# Altium schematic sheet PA_Combined_RX_TX.SchDoc
size A2; SheetNumber: 1; SheetTotal: 1
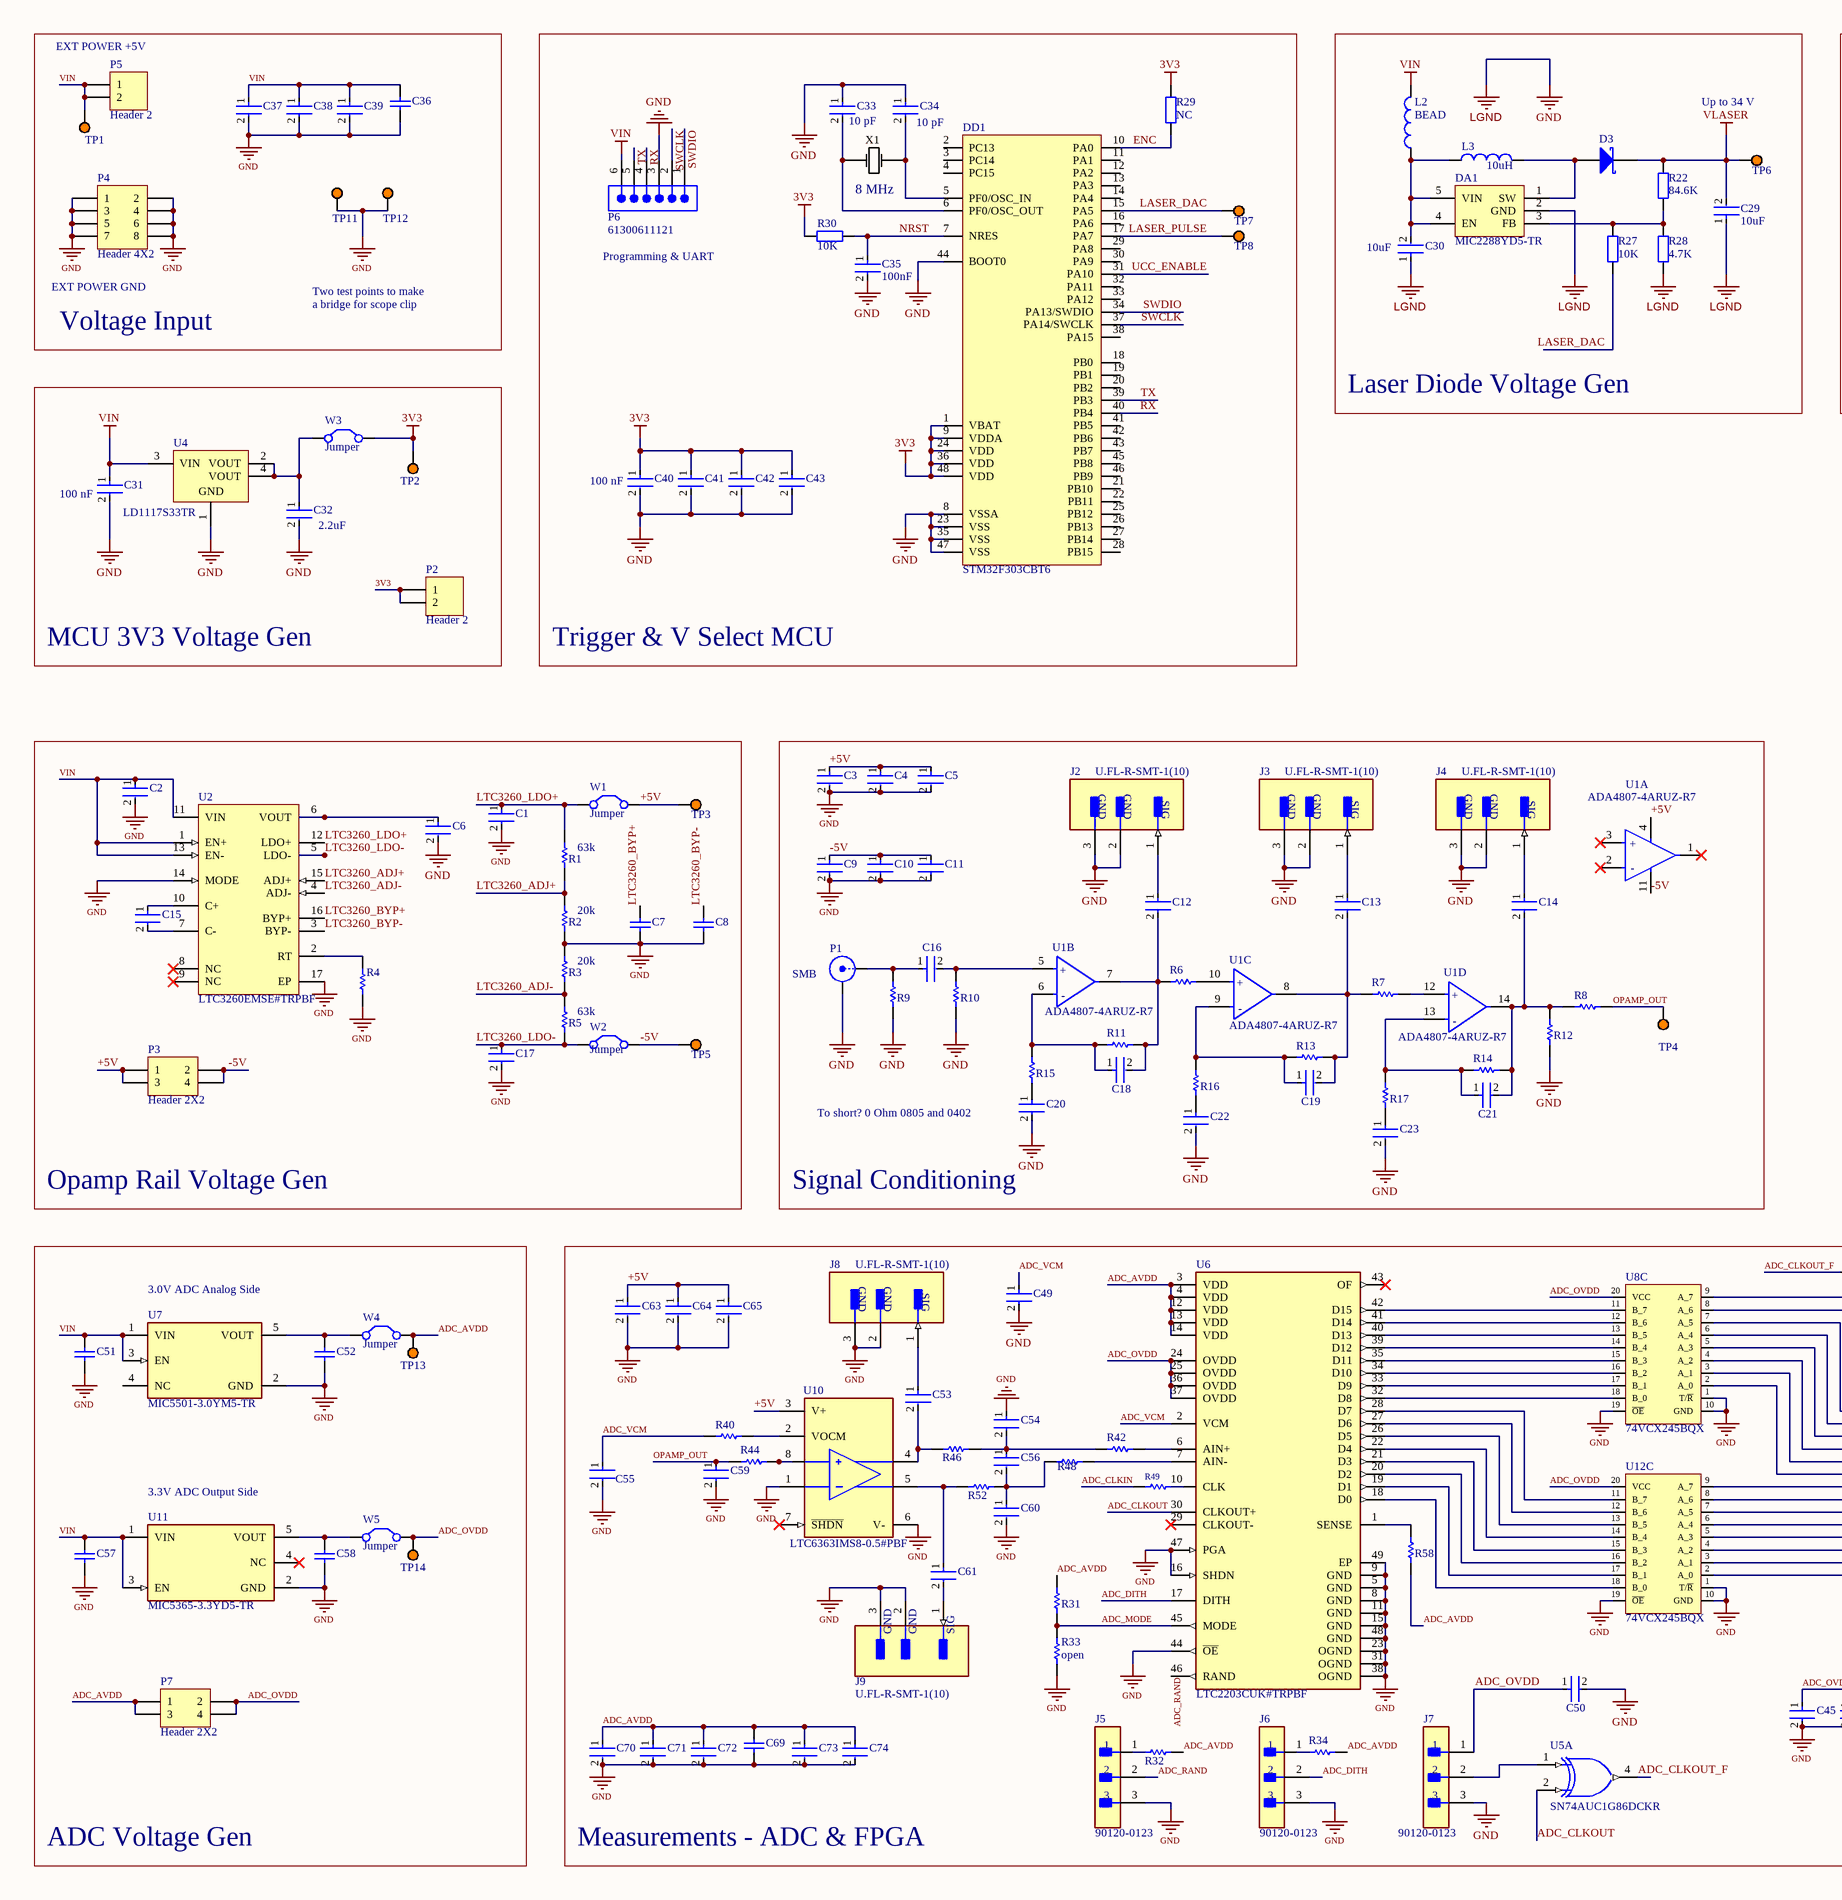
[diagram p0: PA_Combined_RX_TX.SchDoc, left]
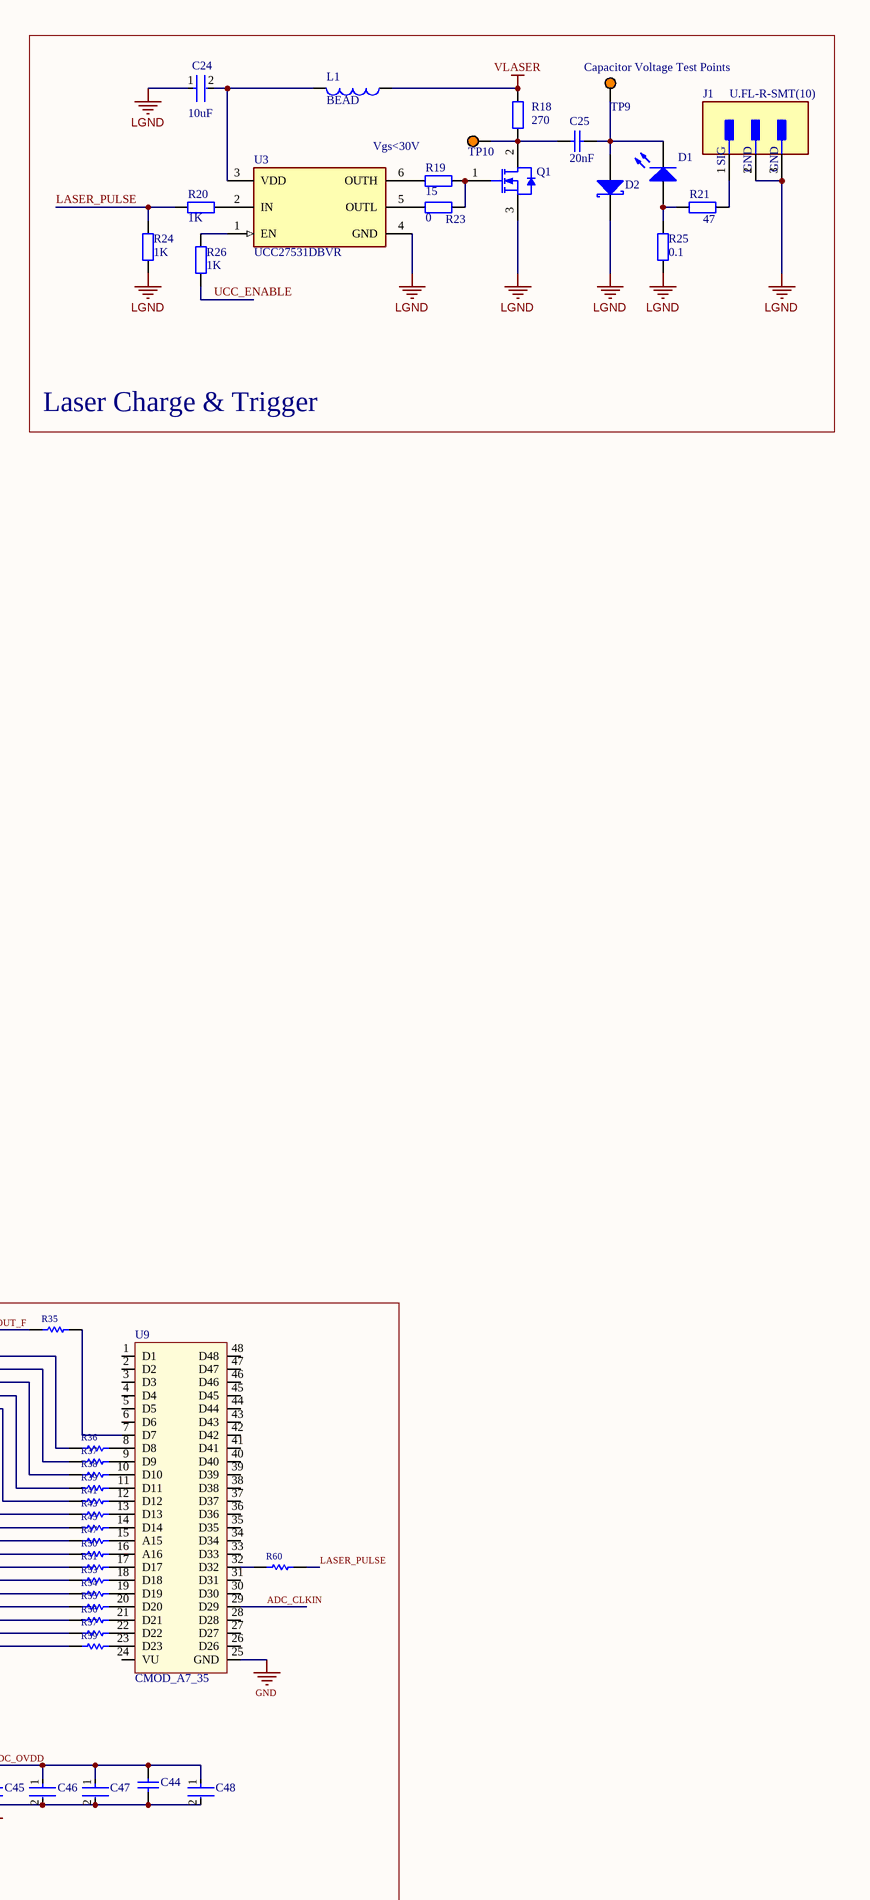
[diagram p1: PA_Combined_RX_TX.SchDoc, right]

## Parts
C1  CL21B106KOQNNNG  [FP-CL21B106KOQNNNG-MFG]  (value not drawn)
C2  CL21B106KOQNNNG  [FP-CL21B106KOQNNNG-MFG]  (value not drawn)
C3  CL21B106KOQNNNG  [FP-CL21B106KOQNNNG-MFG]  (value not drawn)
C4  GRM21BR71C475KE51K  [FP-GRM21B-0_15-MFG]  (value not drawn)
C5  C0805C104K5RACTU  [FP-C0805C-DN-MFG]  (value not drawn)
C6  CL21B106KOQNNNG  [FP-CL21B106KOQNNNG-MFG]  (value not drawn)
C7  C0805F103K5RACTU  [CAPC2013X100X50NL20T25]  (value not drawn)
C8  C0805F103K5RACTU  [CAPC2013X100X50NL20T25]  (value not drawn)
C9  CL21B106KOQNNNG  [FP-CL21B106KOQNNNG-MFG]  (value not drawn)
C10  GRM21BR71C475KE51K  [FP-GRM21B-0_15-MFG]  (value not drawn)
C11  C0805C104K5RACTU  [FP-C0805C-DN-MFG]  (value not drawn)
C12  C0805C102K5RACTU  [FP-C0805C-DN-MFG]  (value not drawn)
C13  C0805C102K5RACTU  [FP-C0805C-DN-MFG]  (value not drawn)
C14  C0805C102K5RACTU  [FP-C0805C-DN-MFG]  (value not drawn)
C15  CL21B105KAFNNNG  [FP-CL21-IPC_C]  (value not drawn)
C16  CL21B222JBANNNC  [FP-CL21-IPC_B]  (value not drawn)
C17  CL21B106KOQNNNG  [FP-CL21B106KOQNNNG-MFG]  (value not drawn)
C18  C0805C150K5RACTU  [FP-C0805C-DN-MFG]  (value not drawn)
C19  C0805C150K5RACTU  [FP-C0805C-DN-MFG]  (value not drawn)
C20  CL21B106KOQNNNG  [FP-CL21B106KOQNNNG-MFG]  (value not drawn)
C21  C0805C150K5RACTU  [FP-C0805C-DN-MFG]  (value not drawn)
C22  CL21B106KOQNNNG  [FP-CL21B106KOQNNNG-MFG]  (value not drawn)
C23  CL21B106KOQNNNG  [FP-CL21B106KOQNNNG-MFG]  (value not drawn)
C24  10uF  [FP-CL31B106KBHNNNE-MFG]
C25  20nF  [RESC2013X60X35ML10T20]
C29  10uF  [FP-CL31B106KBHNNNE-MFG]
C30  10uF  [FP-CL31B106KBHNNNE-MFG]
C31  value 100 nF  [FP-CC0603-DA-MFG]
C32  Capacitance: 2.2uF  [FP-CL10-IPC_A]
C33  value 10 pF  [FP-C0805C-DN-MFG]  (hidden comment: C0805C100J5RACTU)
C34  value 10 pF  [FP-C0805C-DN-MFG]
C35  100nF  [FP-CC0805-0_85-MFG]
C36  C0805C105K3RACTU  [CAPC2013X140X50LL20T25]  (value not drawn)
C37  CL21B106KOQNNNG  [FP-CL21B106KOQNNNG-MFG]  (value not drawn)
C38  GRM21BR71C475KE51K  [FP-GRM21B-0_15-MFG]  (value not drawn)
C39  C0805C104K5RACTU  [FP-C0805C-DN-MFG]  (value not drawn)
C40  Capacitance: 100 nF  [FP-CC0805-0_85-MFG]  (hidden comment: CC0805KRX7R9BB104)
C41  CC0805KRX7R9BB104  [FP-CC0805-0_85-MFG]  (value not drawn)
C42  CC0805KRX7R9BB104  [FP-CC0805-0_85-MFG]  (value not drawn)
C43  CC0805KRX7R9BB104  [FP-CC0805-0_85-MFG]  (value not drawn)
C44  C0805C105K3RACTU  [CAPC2013X140X50LL20T25]  (value not drawn)
C45  CL21B106KOQNNNG  [FP-CL21B106KOQNNNG-MFG]  (value not drawn)
C46  GRM21BR71C475KE51K  [FP-GRM21B-0_15-MFG]  (value not drawn)
C47  C0805C104K5RACTU  [FP-C0805C-DN-MFG]  (value not drawn)
C48  C0805C104K5RACTU  [FP-C0805C-DN-MFG]  (value not drawn)
C49  C2012X7R1C225K125AB  [FP-C2012-125-0_2-MFG]  (value not drawn)
C50  C0805C104K5RACTU  [FP-C0805C-DN-MFG]  (value not drawn)
C51  C0805C105K3RACTU  [CAPC2013X140X50LL20T25]  (value not drawn)
C52  C0805C105K3RACTU  [CAPC2013X140X50LL20T25]  (value not drawn)
C53  C0805C102K5RACTU  [FP-C0805C-DN-MFG]  (value not drawn)
C54  C0805C100J5RACTU  [FP-C0805C-DN-MFG]  (value not drawn)
C55  C0805C104K5RACTU  [FP-C0805C-DN-MFG]  (value not drawn)
C56  C0805C100J5RACTU  [FP-C0805C-DN-MFG]  (value not drawn)
C57  C0805C105K3RACTU  [CAPC2013X140X50LL20T25]  (value not drawn)
C58  C0805C105K3RACTU  [CAPC2013X140X50LL20T25]  (value not drawn)
C59  C0805C100J5RACTU  [FP-C0805C-DN-MFG]  (value not drawn)
C60  C0805C100J5RACTU  [FP-C0805C-DN-MFG]  (value not drawn)
C61  C0805C102K5RACTU  [FP-C0805C-DN-MFG]  (value not drawn)
C63  CL21B106KOQNNNG  [FP-CL21B106KOQNNNG-MFG]  (value not drawn)
C64  GRM21BR71C475KE51K  [FP-GRM21B-0_15-MFG]  (value not drawn)
C65  C0805C104K5RACTU  [FP-C0805C-DN-MFG]  (value not drawn)
C69  C0805C105K3RACTU  [CAPC2013X140X50LL20T25]  (value not drawn)
C70  CL21B106KOQNNNG  [FP-CL21B106KOQNNNG-MFG]  (value not drawn)
C71  GRM21BR71C475KE51K  [FP-GRM21B-0_15-MFG]  (value not drawn)
C72  C0805C104K5RACTU  [FP-C0805C-DN-MFG]  (value not drawn)
C73  C0805C104K5RACTU  [FP-C0805C-DN-MFG]  (value not drawn)
C74  C0805C104K5RACTU  [FP-C0805C-DN-MFG]  (value not drawn)
D1  Light-Emitting Diode  [FP-DPGEW1S09H-MFG]  (value not drawn)
D2  Schottky Diode  [FP-PG-SC79-2-MFG]  (value not drawn)
D3  Schottky Diode  [FP-PG-SC79-2-MFG]  (value not drawn)
DA1  MIC2288YD5-TR  [FP-TSOT-5LD-PL-1-IPC_A]
DD1  STM32F303CBT6  [STM-LQFP48_L]
J1  U.FL-R-SMT(10)  [FP-U_FL-R-SMT_10-MFG]
J2  U.FL-R-SMT-1(10)  [FP-U_FL-R-SMT-1_10-MFG]
J3  U.FL-R-SMT-1(10)  [FP-U_FL-R-SMT-1_10-MFG]
J4  U.FL-R-SMT-1(10)  [FP-U_FL-R-SMT-1_10-MFG]
J5  90120-0123  [FP-90120-0123-MFG]
J6  90120-0123  [FP-90120-0123-MFG]
J7  90120-0123  [FP-90120-0123-MFG]
J8  U.FL-R-SMT-1(10)  [FP-U_FL-R-SMT-1_10-MFG]
J9  U.FL-R-SMT-1(10)  [FP-U_FL-R-SMT-1_10-MFG]
L1  BEAD  [FP-BLM18-0_15-t0_8-IPC_A]
L2  BEAD  [FP-BLM18-0_15-t0_8-IPC_A]
L3  value 10uH  [RESC2013X60X35LL10T20]  (hidden comment: Inductor)
P1  SMB  [SMB_V-RJ45]
P2  Header 2  [HDR1X2]
P3  Header 2X2  [HDR2X2]
P4  Header 4X2  [HDR2X4]
P5  Header 2  [HDR1X2]
P6  61300611121  [61300611121]
P7  Header 2X2  [HDR2X2]
Q1  (no value)  [INF-PG-TO252-3-313_N]
R1  63k  [RESC2013X60X30ML20T20]
R2  20k  [RESC2013X60X30ML20T20]
R3  20k  [RESC2013X60X30ML20T20]
R4  CRCW0805200KFKEA  [RESC2013X50X30NL20T20]  (value not drawn)
R5  63k  [RESC2013X60X30ML20T20]
R6  RC0805FR-071KL  [RESC2013X60X35ML10T20]  (value not drawn)
R7  RC0805FR-071KL  [RESC2013X60X35ML10T20]  (value not drawn)
R8  ERJ-6GEY0R00V  [RESC2013X70X40NL20T20]  (value not drawn)
R9  RK73B2ATTD510J  [RESC2013X60X30ML20T20]  (value not drawn)
R10  RK73B2ATTD510J  [RESC2013X60X30ML20T20]  (value not drawn)
R11  RC0805FR-071KL  [RESC2013X60X35ML10T20]  (value not drawn)
R12  RK73B2ATTD510J  [RESC2013X60X30ML20T20]  (value not drawn)
R13  RC0805FR-071KL  [RESC2013X60X35ML10T20]  (value not drawn)
R14  RC0805FR-071KL  [RESC2013X60X35ML10T20]  (value not drawn)
R15  RC0805FR-07100RL  [RESC2013X60X35ML10T20]  (value not drawn)
R16  RC0805FR-07100RL  [RESC2013X60X35ML10T20]  (value not drawn)
R17  RC0805FR-07100RL  [RESC2013X60X35ML10T20]  (value not drawn)
R18  270  [FP-CL31B106KBHNNNE-IPC_A]
R19  15  [RESC2013X60X35ML10T20]
R20  1K  [RESC2013X60X35ML10T20]
R21  47  [RESC2013X60X35ML10T20]
R22  84.6K  [RESC2013X60X35ML10T20]
R23  0  [RESC2013X60X35ML10T20]
R24  1K  [RESC2013X60X35ML10T20]
R25  0.1  [RESC2013X60X35NL10T20]
R26  1K  [RESC2013X60X35ML10T20]
R27  10K  [RESC2013X60X35ML10T20]
R28  4.7K  [RESC2013X60X35ML10T20]
R29  NC  [RESC2013X60X35ML10T20]
R30  10K  [RESC2013X60X35ML10T20]
R31  RC0805FR-071KL  [RESC2013X60X35ML10T20]  (value not drawn)
R32  RK73H2ATTD1002F  [RESC2013X60X30LL20T20]  (value not drawn)
R33  value open  [RESC2013X60X35LL10T20]  (hidden comment: Resistor)
R34  RK73H2ATTD1002F  [RESC2013X60X30LL20T20]  (value not drawn)
R35  RC0805FR-0733RL  [RESC2013X60X35LL10T20]  (value not drawn)
R36  RC0805FR-0733RL  [RESC2013X60X35LL10T20]  (value not drawn)
R37  RC0805FR-0733RL  [RESC2013X60X35LL10T20]  (value not drawn)
R38  RC0805FR-0733RL  [RESC2013X60X35LL10T20]  (value not drawn)
R39  RC0805FR-0733RL  [RESC2013X60X35LL10T20]  (value not drawn)
R40  RC0805FR-07100RL  [RESC2013X60X35ML10T20]  (value not drawn)
R41  RC0805FR-0733RL  [RESC2013X60X35LL10T20]  (value not drawn)
R42  RC0805JR-075R1L  [RESC2013X60X35LL10T20]  (value not drawn)
R43  RC0805FR-0733RL  [RESC2013X60X35LL10T20]  (value not drawn)
R44  ERJ-6GEY0R00V  [RESC2013X70X40NL20T20]  (value not drawn)
R45  RC0805FR-0733RL  [RESC2013X60X35LL10T20]  (value not drawn)
R46  RK73B2ATTD510J  [RESC2013X60X30ML20T20]  (value not drawn)
R47  RC0805FR-0733RL  [RESC2013X60X35LL10T20]  (value not drawn)
R48  RC0805JR-075R1L  [RESC2013X60X35LL10T20]  (value not drawn)
R49  RC0805FR-0733RL  [RESC2013X60X35LL10T20]  (value not drawn)
R50  RC0805FR-0733RL  [RESC2013X60X35LL10T20]  (value not drawn)
R51  RC0805FR-0733RL  [RESC2013X60X35LL10T20]  (value not drawn)
R52  RK73B2ATTD510J  [RESC2013X60X30ML20T20]  (value not drawn)
R53  RC0805FR-0733RL  [RESC2013X60X35LL10T20]  (value not drawn)
R54  RC0805FR-0733RL  [RESC2013X60X35LL10T20]  (value not drawn)
R55  RC0805FR-0733RL  [RESC2013X60X35LL10T20]  (value not drawn)
R56  RC0805FR-0733RL  [RESC2013X60X35LL10T20]  (value not drawn)
R57  RC0805FR-0733RL  [RESC2013X60X35LL10T20]  (value not drawn)
R58  RK73H2ATTD10R0F  [RESC2013X60X30ML20T20]  (value not drawn)
R59  RC0805FR-0733RL  [RESC2013X60X35LL10T20]  (value not drawn)
R60  RC0805FR-0733RL  [RESC2013X60X35LL10T20]  (value not drawn)
TP1  5003  [TP_TH]  (value not drawn)
TP2  5003  [TP_TH]  (value not drawn)
TP3  5003  [TP_TH]  (value not drawn)
TP4  5003  [TP_TH]  (value not drawn)
TP5  5003  [TP_TH]  (value not drawn)
TP6  5003  [TP_TH]  (value not drawn)
TP7  5003  [TP_TH]  (value not drawn)
TP8  5003  [TP_TH]  (value not drawn)
TP9  5003  [TP_TH]  (value not drawn)
TP10  5003  [TP_TH]  (value not drawn)
TP11  5003  [TP_TH]  (value not drawn)
TP12  5003  [TP_TH]  (value not drawn)
TP13  5003  [TP_TH]  (value not drawn)
TP14  5003  [TP_TH]  (value not drawn)
U1  ADA4807-4ARUZ-R7  [FP-RU-14-IPC_B]  (parts A,B,C,D of 4)
U2  LTC3260EMSE#TRPBF  [LT-MSE-16-EDP_L]
U3  UCC27531DBVR  [FP-DBV0006A-IPC_B]
U4  LD1117S33TR  [SOT-223_L]
U5  SN74AUC1G86DCKR  [DCK0005A_N]  (part A of 2)
U6  LTC2203CUK#TRPBF  [FP-UK-48-05-08-1704-IPC_C]
U7  MIC5501-3.0YM5-TR  [FP-SOT23-5LD-PL-1-MFG]
U8  74VCX245BQX  [QFN21P50_450X250X80L40X24T305X105N]  (part C of 3)
U9  CMOD_A7_35  [PCBComponent_1 - duplicate]
U10  LTC6363IMS8-0.5#PBF  [FP-MS8-8-05-08-1660-IPC_A]
U11  MIC5365-3.3YD5-TR  [FP-TSOT-5LD-PL-1-IPC_C]
U12  74VCX245BQX  [QFN21P50_450X250X80L40X24T305X105N]  (part C of 3)
W1  Jumper  [FP-M20-9990246-MFG]
W2  Jumper  [FP-M20-9990246-MFG]
W3  Jumper  [FP-M20-9990246-MFG]
W4  Jumper  [FP-M20-9990246-MFG]
W5  Jumper  [FP-M20-9990246-MFG]
X1  value 8 MHz  [FP-ASFL1-MFG]  (hidden comment: Quartz)

## Blocks framed on the sheet
Voltage Input: C36-C39 P4 P5 TP1 TP11 TP12
Trigger & V Select MCU: C33-C35 C40-C43 DD1 P6 R29 R30 TP7 TP8 X1
Laser Diode Voltage Gen: C29 C30 D3 DA1 L2 L3 R22 R27 R28 TP6
Laser Charge & Trigger: C24 C25 D1 D2 J1 L1 Q1 R18-R21 R23-R26 TP9 TP10 U3
MCU 3V3 Voltage Gen: C31 C32 P2 TP2 U4 W3
Opamp Rail Voltage Gen: C1 C2 C6-C8 C15 C17 P3 R1-R5 TP3 TP5 U2 W1 W2
Signal Conditioning: C3-C5 C9-C14 C16 C18-C23 J2-J4 P1 R6-R17 TP4 U1
ADC Voltage Gen: C51 C52 C57 C58 P7 TP13 TP14 U7 U11 W4 W5
Measurements - ADC & FPGA: C44-C50 C53-C56 C59-C61 C63-C65 C69-C74 J5-J9 R31-R60 U5 U6 U8-U10 U12

## Nets
3V3: C40.1 C41.1 C42.1 C43.1 DD1.1(VBAT) DD1.9(VDDA) DD1.24(VDD) DD1.36(VDD) DD1.48(VDD) P2.1 P2.2 R29.1 R30.1 TP2.1 W3.2(C2)
GND: C1.2 C2.2 C3.2 C4.2 C5.2 C6.2 C7.1 C8.1 C9.2 C10.2 C11.2 C17.2 C20.2 C22.2 C23.2 C24.1 C29.1 C30.1 C31.2 C32.2 C33.1 C34.1 C35.2 C36.1 C37.2 C38.2 C39.2 C40.2 C41.2 C42.2 C43.2 C44.1 C45.2 C46.2 C47.2 C48.2 C49.2 C50.2 C51.1 C52.1 C54.1 C55.2 C57.1 C58.1 C59.2 C60.2 C63.2 C64.2 C65.2 C69.1 C70.2 C71.2 C72.2 C73.2 C74.2 D2.2(K) DA1.2(GND) DD1.8(VSSA) DD1.23(VSS) DD1.35(VSS) DD1.44(BOOT0) DD1.47(VSS) J1.2(GND) J1.3(GND) J2.2(GND) J2.3(GND) J3.2(GND) J3.3(GND) J4.2(GND) J4.3(GND) J5.3 J6.3 J7.3 J8.2(GND) J8.3(GND) J9.2(GND) J9.3(GND) P1.2(Y) P4.1 P4.2 P4.3 P4.4 P4.5 P4.6 P4.7 P4.8 P6.3 Q1.3(SOURCE) R2.1 R3.2 R4.1 R9.1 R10.1 R12.1 R24.1 R25.1 R28.1 R33.1 TP11.1 TP12.1 U2.14(MODE) U2.17(EP) U3.4(GND) U4.1(GND) U6.5(GND) U6.8(GND) U6.9(GND) U6.11(GND) U6.15(GND) U6.16(SHDN) U6.23(OGND) U6.31(OGND) U6.38(OGND) U6.44(~{OE}) U6.47(PGA) U6.48(GND) U6.49(EP) U7.2(GND) U8.1(T/~{R}) U8.10(GND) U8.19(~{OE}) U9.25(GND) U10.1(-IN) U10.6(V-) U11.2(GND) U12.1(T/~{R}) U12.10(GND) U12.19(~{OE})  [also labelled LGND]
VIN: C2.1 C31.1 C36.2 C37.1 C38.1 C39.1 C51.2 C57.2 L2.2 P5.1 P5.2 P6.6 TP1.1 U2.1(EN+) U2.11(VIN) U2.13(EN-) U4.3(VIN) U7.1(VIN) U7.3(EN) U11.1(VIN) U11.3(EN)
VLASER: C29.2 D3.2(K) L1.1 R18.2 R22.2 TP6.1
+5V: C3.1 C4.1 C5.1 C63.1 C64.1 C65.1 P3.1 P3.3 TP3.1 U1.4(+VS) U10.3(V+) W1.2(C2)
-5V: C9.1 C10.1 C11.1 P3.2 P3.4 TP5.1 U1.11(-VS) W2.2(C2)
ADC_AVDD: C69.2 C70.1 C71.1 C72.1 C73.1 C74.1 P7.1 P7.3 R31.2 R32.2 R34.2 R58.2 TP13.1 U6.3(VDD) U6.4(VDD) U6.12(VDD) U6.13(VDD) U6.14(VDD) W4.2(C2)
ADC_CLKIN: R49.1 U9.29(D29)
ADC_CLKOUT: U5.2(B) U6.30(CLKOUT+)
ADC_CLKOUT_F: R35.1 U5.4(Y)
ADC_DITH: J6.2 U6.17(DITH)
ADC_MODE: R31.1 R33.2 U6.45(MODE)
ADC_OVDD: C44.2 C45.1 C46.1 C47.1 C48.1 C50.1 J7.1 P7.2 P7.4 TP14.1 U6.24(OVDD) U6.25(OVDD) U6.36(OVDD) U6.37(OVDD) U8.20(VCC) U12.20(VCC) W5.2(C2)
ADC_RAND: J5.2 U6.46(RAND)
ADC_VCM: C49.1 C55.1 R40.1 U6.2(VCM)
ENC: DD1.10(PA0) R29.2
LASER_DAC: DD1.15(PA5) R27.1 TP7.1
LASER_PULSE: DD1.17(PA7) R20.2 R24.2 R60.2 TP8.1
LTC3260_ADJ+: R1.1 R2.2 U2.15(ADJ+)
LTC3260_ADJ-: R3.1 R5.2 U2.4(ADJ-)
LTC3260_BYP+: C7.2 U2.16(BYP+)
LTC3260_BYP-: C8.2 U2.3(BYP-)
LTC3260_LDO+: C1.1 R1.2 U2.12(LDO+) W1.1(C1)
LTC3260_LDO-: C17.1 R5.1 U2.5(LDO-) W2.1(C1)
NRST: C35.1 DD1.7(NRES) R30.2
OPAMP_OUT: C59.1 R8.2 R44.1 TP4.1
RX: DD1.40(PB4) P6.4
SWCLK: DD1.37(PA14/SWCLK) P6.2
SWDIO: DD1.34(PA13/SWDIO) P6.1
TX: DD1.39(PB3) P6.5
UCC_ENABLE: DD1.31(PA10) R26.1
NetC6_1: C6.1 U2.6(VOUT)
NetC12_1: C12.1 J2.1(SIG)
NetC12_2: C12.2 C18.2 R6.1 R11.2 U1.7(VOUT2)
NetC13_1: C13.1 J3.1(SIG)
NetC13_2: C13.2 C19.2 R7.1 R13.2 U1.8(VOUT3)
NetC14_1: C14.1 J4.1(SIG)
NetC14_2: C14.2 C21.2 R8.1 R12.2 R14.2 U1.14(VOUT4)
NetC15_1: C15.1 U2.10(C+)
NetC15_2: C15.2 U2.7(C-)
NetC16_1: C16.1 P1.1(X) R9.2
NetC16_2: C16.2 R10.2 U1.5(+IN2)
NetC18_1: C18.1 R11.1 R15.1 U1.6(-IN2)
NetC19_1: C19.1 R13.1 R16.1 U1.9(-IN3)
NetC20_1: C20.1 R15.2
NetC21_1: C21.1 R14.1 R17.1 U1.13(-IN4)
NetC22_1: C22.1 R16.2
NetC23_1: C23.1 R17.2
NetC24_2: C24.2 L1.2 U3.3(VDD)
NetC25_1: C25.1 D1.2(K) D2.1(A) TP9.1
NetC25_2: C25.2 Q1.2(DRAIN) R18.1 TP10.1
NetC30_2: C30.2 DA1.4(EN) DA1.5(VIN) L2.1 L3.1
NetC32_1: C32.1 U4.2(VOUT) U4.4(VOUT) W3.1(C1)
NetC33_2: C33.2 DD1.6(PF0/OSC_OUT) X1.1
NetC34_2: C34.2 DD1.5(PF0/OSC_IN) X1.3
NetC52_2: C52.2 U7.5(VOUT) W4.1(C1)
NetC53_1: C53.1 J8.1(SIG)
NetC53_2: C53.2 R46.2 U10.4(+OUT)
NetC54_2: C54.2 C56.1 R42.1 R46.1
NetC56_2: C56.2 C60.1 R48.1 R52.1
NetC58_2: C58.2 U11.5(VOUT) W5.1(C1)
NetC61_1: C61.1 R52.2 U10.5(-OUT)
NetC61_2: C61.2 J9.1(SIG)
NetD1_1: D1.1(A) R21.1 R25.2
NetD3_1: D3.1(A) DA1.1(SW) L3.2
NetDA1_3: DA1.3(FB) R22.1 R27.2 R28.2
NetJ1_1: J1.1(SIG) R21.2
NetJ5_1: J5.1 R32.1
NetJ6_1: J6.1 R34.1
NetJ7_2: J7.2 U5.1(A)
NetQ1_1: Q1.1(GATE) R19.1 R23.1
NetR4_2: R4.2 U2.2(RT)
NetR6_2: R6.2 U1.10(+IN3)
NetR7_2: R7.2 U1.12(+IN4)
NetR19_2: R19.2 U3.6(OUTH)
NetR20_1: R20.1 U3.2(IN)
NetR23_2: R23.2 U3.5(OUTL)
NetR26_2: R26.2 U3.1(EN)
NetR35_2: R35.2 U9.7(D7)
NetR36_1: R36.1 U8.9(A_7)
NetR36_2: R36.2 U9.8(D8)
NetR37_1: R37.1 U8.8(A_6)
NetR37_2: R37.2 U9.9(D9)
NetR38_1: R38.1 U8.7(A_5)
NetR38_2: R38.2 U9.10(D10)
NetR39_1: R39.1 U8.6(A_4)
NetR39_2: R39.2 U9.11(D11)
NetR40_2: R40.2 U10.2(VOCM)
NetR41_1: R41.1 U8.5(A_3)
NetR41_2: R41.2 U9.12(D12)
NetR42_2: R42.2 U6.6(AIN+)
NetR43_1: R43.1 U8.4(A_2)
NetR43_2: R43.2 U9.13(D13)
NetR44_2: R44.2 U10.8(+IN)
NetR45_1: R45.1 U8.3(A_1)
NetR45_2: R45.2 U9.14(D14)
NetR47_1: R47.1 U8.2(A_0)
NetR47_2: R47.2 U9.15(A15)
NetR48_2: R48.2 U6.7(AIN-)
NetR49_2: R49.2 U6.10(CLK)
NetR50_1: R50.1 U12.9(A_7)
NetR50_2: R50.2 U9.16(A16)
NetR51_1: R51.1 U12.8(A_6)
NetR51_2: R51.2 U9.17(D17)
NetR53_1: R53.1 U12.7(A_5)
NetR53_2: R53.2 U9.18(D18)
NetR54_1: R54.1 U12.6(A_4)
NetR54_2: R54.2 U9.19(D19)
NetR55_1: R55.1 U12.5(A_3)
NetR55_2: R55.2 U9.20(D20)
NetR56_1: R56.1 U12.4(A_2)
NetR56_2: R56.2 U9.21(D21)
NetR57_1: R57.1 U12.3(A_1)
NetR57_2: R57.2 U9.22(D22)
NetR58_1: R58.1 U6.1(SENSE)
NetR59_1: R59.1 U12.2(A_0)
NetR59_2: R59.2 U9.23(D23)
NetR60_1: R60.1 U9.32(D32)
NetU6_18: U6.18(D0) U12.18(B_0)
NetU6_19: U6.19(D1) U12.17(B_1)
NetU6_20: U6.20(D2) U12.16(B_2)
NetU6_21: U6.21(D3) U12.15(B_3)
NetU6_22: U6.22(D4) U12.14(B_4)
NetU6_26: U6.26(D5) U12.13(B_5)
NetU6_27: U6.27(D6) U12.12(B_6)
NetU6_28: U6.28(D7) U12.11(B_7)
NetU6_32: U6.32(D8) U8.18(B_0)
NetU6_33: U6.33(D9) U8.17(B_1)
NetU6_34: U6.34(D10) U8.16(B_2)
NetU6_35: U6.35(D11) U8.15(B_3)
NetU6_39: U6.39(D12) U8.14(B_4)
NetU6_40: U6.40(D13) U8.13(B_5)
NetU6_41: U6.41(D14) U8.12(B_6)
NetU6_42: U6.42(D15) U8.11(B_7)

Not connected (* = marked no-connect by the designer): DD1 2(PC13) 3(PC14) 4(PC15) 11(PA1) 12(PA2) 13(PA3) 14(PA4) 16(PA6) 18(PB0) 19(PB1) 20(PB2) 21(PB10) 22(PB11) 25(PB12) 26(PB13) 27(PB14) 28(PB15) 29(PA8) 30(PA9) 32(PA11) 33(PA12) 38(PA15) 41(PB5) 42(PB6) 43(PB7) 45(PB8) 46(PB9); U1 1(VOUT1)* 2(-IN1)* 3(+IN1)*; U2 8(NC)* 9(NC)*; U6 29(CLKOUT-)* 43(OF)*; U7 4(NC); U9 1(D1) 2(D2) 3(D3) 4(D4) 5(D5) 6(D6) 24(VU) 26(D26) 27(D27) 28(D28) 30(D30) 31(D31) 33(D33) 34(D34) 35(D35) 36(D36) 37(D37) 38(D38) 39(D39) 40(D40) 41(D41) 42(D42) 43(D43) 44(D44) 45(D45) 46(D46) 47(D47) 48(D48); U10 7(~{SHDN})*; U11 4(NC)*

## Notes on the sheet
- (near P5) EXT POWER +5V
- (near TP9) Capacitor Voltage Test Points
- Up to 34 V
- Vgs<30V
- Programming & UART
- (near P4) EXT POWER GND
- Two test points to make
- a bridge for scope clip
- To short? 0 Ohm 0805 and 0402
- (near U7) 3.0V ADC Analog Side
- (near U11) 3.3V ADC Output Side
- (in symbol CMP-09116-000192-1, part A) +; -
- (in symbol CMP-09116-000192-1, part B) +; -
- (in symbol CMP-09116-000192-1, part C) +; -
- (in symbol CMP-09116-000192-1, part D) +; -

## Library data of the parts
C1-C3 C6 C9 C17 C20 C22 C23 C37 C45 C63 C70 = CMP-13271-000015-1: CAP CER 10UF 16V X7R 0805; Manufacturer: Samsung Electro-Mechanics; Temperature Coefficient: 15%; Tolerance: 10%; Material: Ceramic; ComponentLink2URL: http://product.samsungsem.com/mlcc/CL21B106KOQNNN.do; Package: 0; Voltage Rating: 16V; Value: 10uF; Height: 1.4mm; Temperature Characteristic: X7R; Manufacturer Part Number: CL21B106KOQNNNG; Category: Cap; Lead Free: Yes; RoHS: TRUE; ComponentLink2Description: Datasheet; Octopart: https://octopart.com/cl21b106koqnnng-samsung-19995691; Device Class L1: Passive Components; Temperature Range Low: -55°C; Device Class L3: Ceramic Capacitors; Ipc Land Pattern Name: CAPC200125X125; Digikey Description: CAP CER 10UF 16V X7R 0805; Automotive: No; Capacitance: 10uF; Temperature Range High: +125°C; Device Class L2: Capacitors; Temperature: -55°C to +125°C
C4 C10 C38 C46 C64 C71 = CMP-06035-031349-1: Chip Multilayer Ceramic Capacitors for General Purpose, 0805, 4.7uF, X7R, 15%, 10%, 16V; Dielectric: X7R; Length: 2mm; Tolerance: 10%; Capacitance: 4.7uF; Voltage Rating (DC): 16V; Width: 1.25mm; Thickness: 1.25mm; Case/Package: 0805
C5 C11 C39 C47 C48 C50 C55 C65 C72-C74 = CMP-2007-00279-2: CAP CER 0.1UF 50V X7R 0805; Manufacturer: KEMET; Value: 0.10 μF; Tolerance: 0.1; Temperature Coefficient: 30ppm/°C; Material: Ceramic; Manufacturer Part Number: C0805C104K5RACTU; Device Class L2: Capacitors; Temperature Range Low: -55°C; Voltage Rating: 50 V; Digikey Description: CAP CER 0.1UF 50V X7R 0805; Category: Cap; ComponentLink2Description: Datasheet; Octopart: https://octopart.com/c0805c104k5ractu-kemet-143926; RoHS: TRUE; ComponentLink2URL: https://content.kemet.com/datasheets/KEM_C1003_C0G_SMD.pdf; Temperature Characteristic: X7R; Temperature: -55°C to +125°C; Height: 0.88mm; Temperature Range High: +125°C; Device Class L1: Passive Components; Automotive: No; Lead Free: Yes; Ipc Land Pattern Name: CAPC200125X78; Device Class L3: Ceramic Capacitors; Mouser Description: Cap Ceramic 0.1uF 50V X7R 10% SMD 2.0 x 1.2 mm 125 C Paper T/R; Capacitance: 0.10 μF; Package: C0805C-DN
C7 C8 = CMP-2007-03708-1: Manufacturer: Kemet; Part Number: C0805F103K5RACTU
C12-C14 C53 C61 = CMP-2007-01097-2: CAP CER 1000PF 50V X7R 0805; Manufacturer: KEMET; Capacitance: 1,000 pF; Value: 1,000 pF; Tolerance: 0.1; Temperature Coefficient: 30ppm/°C; Material: Ceramic; Temperature Range High: +125°C; Automotive: No; Device Class L3: Ceramic Capacitors; Category: Cap; Height: 0.88mm; Ipc Land Pattern Name: CAPC200125X78; Mouser Description: Cap Ceramic 0.001uF 50V X7R 10% SMD 0805 125C Plastic T/R; Device Class L1: Passive Components; Lead Free: Yes; Temperature Range Low: -55°C; ComponentLink2URL: https://content.kemet.com/datasheets/KEM_C1003_C0G_SMD.pdf; Octopart: https://octopart.com/c0805c102k5ractu-kemet-93010; Temperature: -55°C to +125°C; Package: C0805C-DN; RoHS: TRUE; Voltage Rating: 50 V; ComponentLink2Description: Datasheet; Digikey Description: CAP CER 1000PF 50V X7R 0805; Device Class L2: Capacitors; Manufacturer Part Number: C0805C102K5RACTU; Temperature Characteristic: X7R
C15 = CMP-13271-003813-1: CL21 Series 0805 1uF 25V ±10% Tolerance X7R Multilayer Ceramic Chip Capacitor; Case Code (Imperial): 0805; Length: 2mm; Max Operating Temperature: 125°C; Tolerance: 10%; Depth: 1.25mm; Package Quantity: 3000; Material: Ceramic; Voltage Rating: 25V; Capacitance: 1uF; Height: 1.25mm; Mount: Surface Mount; Dielectric: X7R; Packaging: Tape and Reel; Voltage: 25V; Case/Package: 0805; Radiation Hardening: No; Thickness: 0.053inch; Width: 0.049inch; Min Operating Temperature: -55°C; Case Code (Metric): 2012
C16 = CMP-13271-000077-1: CL21 Series 0805 2.2nF 50V ±5% Tolerance X7R Multilayer Ceramic Chip Capacitor; Voltage Rating: 50V; Case/Package: 0805; Voltage Rating (DC): 50V; Dielectric: X7R; Lead Free: Lead Free; Max Operating Temperature: 125°C; Width: 0.049inch; Case Code (Imperial): 0805; Case Code (Metric): 2012; Tolerance: 5%; Length: 2mm; Mount: Surface Mount; Contact Plating: Tin; Voltage: 50V; Height: 0.65mm; Package Quantity: 4000; Thickness: 0.03inch; Depth: 1.25mm; Min Operating Temperature: -55°C; Radiation Hardening: No; Capacitance: 2.2nF; Packaging: Tape and Reel
C18 C19 C21 = CMP-03020-023493-1: CAP CER SMD 0805 15PF 50V 10% X7; Manufacturer: KEMET; Temperature Characteristic: X7R; Tolerance: 0.1; Material: Ceramic; Temperature Coefficient: 30ppm/°C; Octopart: https://octopart.com/c0805c150k5ractu-kemet-88373275; ComponentLink2URL: https://content.kemet.com/datasheets/KEM_C1003_C0G_SMD.pdf; Manufacturer Part Number: C0805C150K5RACTU; Device Class L3: Ceramic Capacitors; Lead Free: Yes; Digikey Description: CAP CER SMD 0805 15PF 50V 10% X7; Value: 15 pF; Mouser Description: Cap Ceramic 15pF 50V X7R 10% SMD 0805 125°C Paper T/R; Automotive: No; Voltage Rating: 50 V; Ipc Land Pattern Name: CAPC200125X78; Height: 0.88mm; Device Class L2: Capacitors; Capacitance: 15 pF; Temperature: -55°C to +125°C; Category: Cap; RoHS: TRUE; Temperature Range High: +125°C; Temperature Range Low: -55°C; Device Class L1: Passive Components; Package: C0805C-DN; ComponentLink2Description: Datasheet
C24 C29 C30 = CMP-2000-07530-2: CAP CER 10UF 50V X7R 1206; Manufacturer: Samsung; Manufacturer Part Number: CL31B106KBHNNNE; Tolerance: 10%; Material: Ceramic; Temperature Coefficient: 15%; Temperature Characteristic: X7R; Digikey Description: CAP CER 10UF 50V X7R 1206; Device Class L1: Passive Components; Value: 10uF; Lead Free: Yes; Device Class L3: Ceramic Capacitors; Octopart: https://octopart.com/cl31b106kbhnnne-samsung-30507377; ComponentLink2URL: http://www.samsungsem.com/global/front/downloadcms.do?path=%2F%2Fglobal%2F%2Fsupport%2F%2Fproduct-search%2F%2Fmlcc%2F%2F__icsFiles%2F%2Fafieldfile%2F%2F2019%2F%2F06%2F%2F18&fileName=CL31B106KBHNNNE-19.pdf; Voltage Rating: 50V; Temperature Range Low: -55°C; RoHS: TRUE; Temperature: -55°C to +125°C; Category: Cap; ComponentLink2Description: Datasheet; Automotive: No; Device Class L2: Capacitors; Capacitance: 10uF; Height: 1.8mm; Temperature Range High: +125°C; Package: CL31B106KBHNNNE
C25 = CC0805: Chip capacitor; Voltage: 50V; Series: X7R; Value: 20nF
C31 = CMP-2000-05002-2: CAP CER 0.1UF 16V X7R 0603; Manufacturer Part Number: CC0603KRX7R7BB104; Manufacturer: YAGEO; Tolerance: 0.1; Temperature Coefficient: 15%; Material: Ceramic; Voltage Rating: 16 V; Package: CC0603-DA; ComponentLink2Description: Datasheet; Octopart: https://octopart.com/cc0603krx7r7bb104-yageo-192941; Temperature Range High: +125°C; Digikey Description: CAP CER 0.1UF 16V X7R 0603; Voltage: 16 V; Device Class L2: Capacitors; Height: 0.9mm; Temperature: -55°C to +125°C; Device Class L1: Passive Components; Device Class L3: Ceramic Capacitors; ComponentLink2URL: http://www.yageo.com/documents/recent/UPY-GPHC_X7R_6.3V-to-50V_18.pdf; Footprint Url: http://www.yageo.com/exep/pages/download/literatures/UPY-C_GEN_24.pdf; RoHS: TRUE; Temperature Range Low: -55°C; Temperature Characteristic: X7R; Lead Free: Yes; Capacitance: 100 nF; Category: Cap; Mouser Description: Multilayer Ceramic Capacitor, CC Series, 0.1 - F, - 10%, X7R, 16 V, 0603 [1608 Metric]; Automotive: No
C32 = CMP-13271-003582-1: Cap Ceramic 2.2uF 10V X7R ±10% Pad SMD 0603 +125°C T/R; Max Operating Temperature: 125°C; Package Quantity: 1; Thickness: 0.035inch; Height: 0.8mm; Case/Package: 0603; Case Code (Metric): 1608; Radiation Hardening: No; Dielectric: X7R; Mount: Surface Mount; Contact Plating: Tin; Material: Ceramic; Length: 1.6mm; Packaging: Tape and Reel; Width: 0.031inch; Min Operating Temperature: -55°C; Case Code (Imperial): 0603; Depth: 0.8mm; Voltage Rating: 10V; Tolerance: 10%
C33 = CMP-03020-021676-1: C0805 10 pF X7R 30ppm/°C 5.00% 50 V; Manufacturer: KEMET; Material: Ceramic; Voltage Rating: 50 V; Tolerance: 0.05; ComponentLink2URL: https://content.kemet.com/datasheets/KEM_C1003_C0G_SMD.pdf; Device Class L2: Capacitors; Octopart: https://octopart.com/c0805c100j5ractu-kemet-81794931; Height: 0.88mm; Ipc Land Pattern Name: CAPC200125X78; ComponentLink2Description: Datasheet; Temperature Range Low: -55°C; Automotive: No; Category: Cap; Device Class L3: Ceramic Capacitors; Device Class L1: Passive Components; Capacitance: 10 pF; Manufacturer Part Number: C0805C100J5RACTU; Temperature Coefficient: 30ppm/°C; Temperature Range High: +125°C; Lead Free: Yes; Package: C0805C-DN; Temperature: -55°C to +125°C; Mouser Description: Cap, 10PF, 50V, Mlcc, 0805; RoHS: TRUE; Temperature Characteristic: X7R
C34 = CMP-03020-021676-1: C0805 10 pF X7R 30ppm/°C 5.00% 50 V; Manufacturer Part Number: C0805C100J5RACTU; Manufacturer: KEMET; Material: Ceramic; Voltage Rating: 50 V; Tolerance: 0.05; ComponentLink2URL: https://content.kemet.com/datasheets/KEM_C1003_C0G_SMD.pdf; Device Class L2: Capacitors; Octopart: https://octopart.com/c0805c100j5ractu-kemet-81794931; Height: 0.88mm; Ipc Land Pattern Name: CAPC200125X78; ComponentLink2Description: Datasheet; Temperature Range Low: -55°C; Automotive: No; Category: Cap; Device Class L3: Ceramic Capacitors; Device Class L1: Passive Components; Capacitance: 10 pF; Temperature Coefficient: 30ppm/°C; Temperature Range High: +125°C; Lead Free: Yes; Package: C0805C-DN; Temperature: -55°C to +125°C; Mouser Description: Cap, 10PF, 50V, Mlcc, 0805; RoHS: TRUE; Temperature Characteristic: X7R
C35 = CMP-2100-03606-3: CAP CER 0.1UF 50V X7R 0805; Manufacturer Part Number: CC0805KRX7R9BB104; Manufacturer: Yageo; Tolerance: 0.1; Material: Ceramic; Device Class L1: Passive Components; ComponentLink2Description: Datasheet; Package: CC0805-0.85; Digikey Description: CAP CER 0.1UF 50V X7R 0805; Capacitance: 100 nF; Device Class L3: Ceramic Capacitors; Value: 100 nF; Temperature: -30°C to +85°C; Temperature Characteristic: X7R; Voltage Rating: 50 V; Height: 0.95mm; RoHS: TRUE; Ipc Land Pattern Name: CAPC200125X85; Device Class L2: Capacitors; Category: Cap; Temperature Range Low: -30°C; Temperature Range High: +85°C; Mouser Description: Multilayer Ceramic Capacitors MLCC - SMD/SMT 100nF 50V X7R 10%; Footprint Url: http://www.yageo.com/exep/pages/download/literatures/UPY-C_GEN_24.pdf; Automotive: No; Octopart: https://octopart.com/cc0805krx7r9bb104-yageo-192993; Lead Free: Yes; ComponentLink2URL: http://www.yageo.com/documents/recent/UPY-GPHC_Y5V_6.3V-to-50V_8.pdf
C36 C44 C51 C52 C57 C58 C69 = CMP-2007-03234-1: Manufacturer: Kemet; Part Number: C0805C105K3RACTU
C40 = CMP-2100-03606-3: CAP CER 0.1UF 50V X7R 0805; Manufacturer: Yageo; Tolerance: 0.1; Value: 100 nF; Material: Ceramic; Device Class L1: Passive Components; ComponentLink2Description: Datasheet; Package: CC0805-0.85; Manufacturer Part Number: CC0805KRX7R9BB104; Digikey Description: CAP CER 0.1UF 50V X7R 0805; Device Class L3: Ceramic Capacitors; Temperature: -30°C to +85°C; Temperature Characteristic: X7R; Voltage Rating: 50 V; Height: 0.95mm; RoHS: TRUE; Ipc Land Pattern Name: CAPC200125X85; Device Class L2: Capacitors; Category: Cap; Temperature Range Low: -30°C; Temperature Range High: +85°C; Mouser Description: Multilayer Ceramic Capacitors MLCC - SMD/SMT 100nF 50V X7R 10%; Footprint Url: http://www.yageo.com/exep/pages/download/literatures/UPY-C_GEN_24.pdf; Automotive: No; Octopart: https://octopart.com/cc0805krx7r9bb104-yageo-192993; Lead Free: Yes; ComponentLink2URL: http://www.yageo.com/documents/recent/UPY-GPHC_Y5V_6.3V-to-50V_8.pdf
C41-C43 = CMP-2100-03606-3: CAP CER 0.1UF 50V X7R 0805; Manufacturer: Yageo; Tolerance: 0.1; Capacitance: 100 nF; Value: 100 nF; Material: Ceramic; Device Class L1: Passive Components; ComponentLink2Description: Datasheet; Package: CC0805-0.85; Manufacturer Part Number: CC0805KRX7R9BB104; Digikey Description: CAP CER 0.1UF 50V X7R 0805; Device Class L3: Ceramic Capacitors; Temperature: -30°C to +85°C; Temperature Characteristic: X7R; Voltage Rating: 50 V; Height: 0.95mm; RoHS: TRUE; Ipc Land Pattern Name: CAPC200125X85; Device Class L2: Capacitors; Category: Cap; Temperature Range Low: -30°C; Temperature Range High: +85°C; Mouser Description: Multilayer Ceramic Capacitors MLCC - SMD/SMT 100nF 50V X7R 10%; Footprint Url: http://www.yageo.com/exep/pages/download/literatures/UPY-C_GEN_24.pdf; Automotive: No; Octopart: https://octopart.com/cc0805krx7r9bb104-yageo-192993; Lead Free: Yes; ComponentLink2URL: http://www.yageo.com/documents/recent/UPY-GPHC_Y5V_6.3V-to-50V_8.pdf
C49 = CMP-08246-006241-1: Multilayer Ceramic Capacitors 2.2μF ±10% 16V X7R SMD 0805; Capacitance: 2.2uF; Radiation Hardening: No; Series: C; REACH SVHC: No SVHC; Max Operating Temperature: 125°C; Case Code (Metric): 2012; Construction: Flat; Lead Free: Lead Free; Number of Pins: 2; Voltage Rating: 16V; Min Operating Temperature: -55°C; Voltage Rating (DC): 16V; Package Quantity: 2000; Thickness: 0.057inch; Case Code (Imperial): 0805; RoHS Compliant: Yes; Length: 2mm; Depth: 1.25mm; Packaging: Tape and Reel; Tolerance: 10%; Mount: Surface Mount; Dielectric: X7R; Width: 1.25mm; Case/Package: 0805; Weight: 0.000194oz; Dielectric Material: Ceramic; Termination: SMD/SMT; Voltage: 16V; Resistor Type: Ceramic; Height: 1.25mm
C54 C56 C59 C60 = CMP-03020-021676-1: C0805 10 pF X7R 30ppm/°C 5.00% 50 V; Manufacturer: KEMET; Material: Ceramic; Value: 10 pF; Voltage Rating: 50 V; Tolerance: 0.05; ComponentLink2URL: https://content.kemet.com/datasheets/KEM_C1003_C0G_SMD.pdf; Device Class L2: Capacitors; Octopart: https://octopart.com/c0805c100j5ractu-kemet-81794931; Height: 0.88mm; Ipc Land Pattern Name: CAPC200125X78; ComponentLink2Description: Datasheet; Temperature Range Low: -55°C; Automotive: No; Category: Cap; Device Class L3: Ceramic Capacitors; Device Class L1: Passive Components; Capacitance: 10 pF; Manufacturer Part Number: C0805C100J5RACTU; Temperature Coefficient: 30ppm/°C; Temperature Range High: +125°C; Lead Free: Yes; Package: C0805C-DN; Temperature: -55°C to +125°C; Mouser Description: Cap, 10PF, 50V, Mlcc, 0805; RoHS: TRUE; Temperature Characteristic: X7R
D1 = LED: AF: 1; BV: 0; BV_MAX: 1e99; EG: 1.11; FC: 0.5; IBV: 0.001; IS: 1e-14; MJSW: 0.33; NTUN: 30; TNOM: 27; XTI: 3; SimulationGenericComponent: True; CJO: 0; CJP: 0; CTA: 0; CTP: 0; FCS: 0.5; FV_MAX: 1e99; IKF: 0; IKR: 0; ISR: 1e-14; JSW: 0; JTUN: 0; JTUNSW: 0; KEG: 1; KF: 0; LEVEL: 1; N: 1; NBV: 1; NR: 1; NS: 1; PHP: 1; RS: 0; TCV: 0; TLEV: 0; TLEVC: 0; TM1: 0; TM2: 0; TPB: 0; TPHP: 0; TRS: 0; TRS2: 0; TT: 0; TTT1: 0; TTT2: 0; VJ: 1; XTITUN: 3
D2 D3 = Schottky Diode: AF: 1; BV: 0; BV_MAX: 1e99; EG: 1.11; FC: 0.5; IBV: 0.001; IS: 1e-14; MJSW: 0.33; NTUN: 30; TNOM: 27; XTI: 3; SimulationGenericComponent: True; CJO: 0; CJP: 0; CTA: 0; CTP: 0; FCS: 0.5; FV_MAX: 1e99; IKF: 0; IKR: 0; ISR: 1e-14; JSW: 0; JTUN: 0; JTUNSW: 0; KEG: 1; KF: 0; LEVEL: 1; N: 1; NBV: 1; NR: 1; NS: 1; PHP: 1; RS: 0; TCV: 0; TLEV: 0; TLEVC: 0; TM1: 0; TM2: 0; TPB: 0; TPHP: 0; TRS: 0; TRS2: 0; TT: 0; TTT1: 0; TTT2: 0; VJ: 1; XTITUN: 3
DA1 = MIC2288: Step Up; Max Volt: 10V; FB_voltage: 1.24V
DD1 = STM32F3_LQFP48: Microcontroller
J1 = CMP-0029-00003-2: CONN U.FL RCPT STR 50 OHM SMD; Plating: Silver; Connector Type: Coaxial; Frequency: 6GHz; Impedance: 50R; Body Material: Bronze; Dielectric Material: Polymer; Contact Plating: Gold; Termination: Solder; Orientation: Vertical; Contact Material: Brass; Min Operating Temperature: -40°C; Mount: Surface Mount; Lead Free: Lead Free; Max Operating Temperature: 90°C; Radiation Hardening: No; Packaging: Tape and Reel; Body Plating: Silver; Fastening Type: Snap; Max Frequency: 6GHz; Depth: 3.1mm; Package Quantity: 1; Case/Package: SMD/SMT; Housing Color: Beige; Length: 3mm
J2-J4 J8 J9 = CMP-2000-05152-3: CONN U.FL RCPT STR 50 OHM SMD; Max Frequency: 6GHz; Connector Type: Coaxial; Body Plating: Silver; Body Material: Bronze; Impedance: 50R; Dielectric Material: Polymer; Insulation Resistance: 500MR; Gender: Male; Packaging: Cut Tape; Length: 3mm; Package Quantity: 2500; Termination: Solder; Lead Free: Lead Free; Series: U.FL; Min Operating Temperature: -40°C; Fastening Type: Snap; Contact Material: Brass; Orientation: Straight; Wire/Cable Type: Coaxial; Frequency: 6GHz; Contact Plating: Gold; Depth: 3.1mm; Weight: 0.001764oz; Max Operating Temperature: 90°C; Radiation Hardening: No; REACH SVHC: No SVHC; Mount: Surface Mount; Housing Color: Beige
J5-J7 = CMP-04776-000237-1: CONN HEADER VERT 3POS 2.54MM; Number of Circuits: 3; Max Voltage Rating (DC): 350.35kV; Contact Resistance: 20mR; Gender: Male; Voltage Rating (AC): 350V; Glow Wire Compliant: Non-compliant; Current Rating: 3A; Contact Post Length: 2.9mm; Number of Contacts: 3; Number of Rows: 1; Max Operating Temperature: 125°C; Orientation: Vertical; Number of Positions: 3; Packaging: Tray; Contact Mating Length: 6.75mm; Housing Color: Black; Termination: Solder; Contact Material: Brass; Radiation Hardening: No; Lead Free: Lead Free; Pitch: 2.54mm; RoHS Compliant: Yes; Voltage Rating: 350V; Contact Plating: Tin; Color: Black; Min Operating Temperature: -55°C; Mount: Through Hole; Housing Material: Polyester; Series: 90120; Contact Gender: Male; REACH SVHC: No SVHC
L1 L2 = BEAD: Ferrit Bead; Created data: 2010-10-16; Value: BEAD
L3 = Inductor: SimulationGenericComponent: True
P1 = SMB: SMB Straight Connector; LatestRevisionDate: 17-Jul-2002; LatestRevisionNote: Re-released for DXP Platform.; Publisher: Altium Limited
P2 P5 = Header 2: Header, 2-Pin; LatestRevisionDate: 17-Jul-2002; LatestRevisionNote: Re-released for DXP Platform.; Publisher: Altium Limited
P3 P7 = Header 2X2: Header, 2-Pin, Dual row; LatestRevisionDate: 17-Jul-2002; LatestRevisionNote: Re-released for DXP Platform.; Publisher: Altium Limited
P4 = Header 4X2: Header, 4-Pin, Dual row; LatestRevisionDate: 17-Jul-2002; LatestRevisionNote: Re-released for DXP Platform.; Publisher: Altium Limited
P6 = CMP-1502-01070-3: NexarPartId: 20084590; Current Rating: 3A; Pitch: 2.54mm; Gender: Male; Operating Supply Voltage: 250V; Connector Type: Male Pin; Number of Positions: 6; Contact Resistance: 20mΩ; Packaging: Bulk; Number of Pins: 6; Number of Rows: 1; Contact Plating: Gold; Lead Free: Lead Free; RoHS: Compliant; Contact Mating Length: 5.9944mm; Voltage Rating: 250V; REACH SVHC: Unknown; Contact Gender: Male; Housing Material: PBT; Min Operating Temperature: -40°C; Lead Pitch: 2.54mm; Mount: Through Hole; Number of Contacts: 6; Max Operating Temperature: 105°C; Contact Material: Copper; Orientation: Vertical; Termination: Through Hole; Color: Black; Height: 8.89mm
Q1 = CMP-1164-00353-1: N-Channel CoolMOS C6 Power-Transistor, 600 V VDS, 8.1 A ID, -55 to 150 degC, PG-TO252-3-313, Reel, Green; Manufacturer: Infineon; PartNumber: IPD60R520C6; QG: 23.4Â nC; VGS(th) (max): 3.5Â V; Green: TRUE; Ptot (max): 66Â W; Polarity: N; RthJC (max): 1.9Â K/W; ID (max): 8.1Â A; VDS (max): 600Â V; RDS (on) (max): 520Â mOhm; RthJA (max): 62Â K/W; IDpuls (max): 22Â A; VGS(th) (min): 2.5Â V; PackageVersion: Oct-10; Packing: Reel; PackageReference: PG-TO252-3-313; Mounting Technology: Surface Mount; ComponentLink1URL: http://www.infineon.com/; ComponentLink3Description: Package Specification; ComponentLink2Description: Datasheet; Rth: 1.9Â K/W; ComponentLink3URL: http://www.infineon.com/dgdl/PG-TO252-3-313-Package_Overview.pdf?folderId=db3a30432b57a660012b81890ade72d2&fileId=db3a30432b57a660012b8193af2872eb; PackageDescription: 3-Pin Plastic (Green) Transistor Single Outline Package, 6.5 x 6.12 mm Body, 2.28 mm Pitch; Technology: CoolMOS C6; ComponentLink1Description: Manufacturer URL; DatasheetVersion: Rev. 2.0; ComponentLink2URL: http://www.infineon.com/dgdl/IPD60R520C6_2.0.pdf?folderId=db3a3043163797a6011638933eda014b&fileId=db3a304323b87bc20123e676d18358fb
R1-R3 R5 = CMP-2001-01840-1: Part Number: RK73B2ATTD510J; Manufacturer: KOA Speer
R4 = CMP-2001-03660-1: Manufacturer: Vishay Dale; Part Number: CRCW0805200KFKEA
R6 R7 R11 R13 R14 R31 = CMP-2100-03671-1: Chip Resistor, 1 KOhm, +/- 1%, 125 mW, -55 to 155 degC, 0805 (2012 Metric), RoHS, Tape and Reel; Manufacturer: Yageo; Temperature Coefficient: 100ppm/degreesC; Voltage Rating (DC): 150V; Max Power Dissipation: 125mW; Resistance: 1KOhm; Number of Pins: 2; Number of Terminations: 2; Datasheet URL: http://www.yageo.com/NewPortal/yageodocoutput?fileName=/pdf/R-Chip/PYu-RC_Group_51_RoHS_L_5.pdf; Length: 0.079inch; Package Description: 2-Pin Surface Mounted Device, Body 2 x 1.25 mm; Depth: 1.25mm; Height: 0.024inch; Military Standard: Not; Case/Package: 0805; Package Reference: 0805; RoHSCompliant: true; Lead Free: LeadFree; Packaging: TapeandReel; Package Quantity: 1; Datasheet Version: Rev. 5, 10/2016; Tolerance: 1%; Min Operating Temperature: -55degC; Voltage Rating: 150V; Composition: ThickFilm; Case Code (Imperial): 0805; Power Rating: 125mW; Width: 0.049inch; Case Code (Metric): 2012; Manufacturer URL: http://www.yageo.com/; Max Operating Temperature: 155degC; REACH SVHC: Unknown; Termination: SMD/SMT
R8 R44 = CMP-1665-00002-5: Chip Resistor, 0 Ohm, +/- 1%, 0.125 W, -55 to 155 degC, 0805 (2012 Metric), RoHS, Tape and Reel; Tolerance: 5%; Resistance: 0 Ohm; REACH SVHC: No SVHC; Min Operating Temperature: -55 degC; Case/Package: 0805; Packaging: Tape and Reel; Package Quantity: 5000; ComponentLink1Description: Manufacturer URL; PackageDescription: 2-Pin Surface Mount Device, Body 2 x 1.25 mm; Mounting Technology: Surface Mount; Max Operating Temperature: 155 degC; PartNumber: ERJ-6GEY0R00V; Width: 1.25 mm; RoHSCompliant: True; Height: 0.6 mm; ComponentLink1URL: http://www.panasonic.com/; ComponentLink2URL: http://industrial.panasonic.com/cdbs/www-data/pdf/RDA0000/AOA0000C84.pdf; Case Code (Imperial): 0805; DatasheetVersion: 03/2015; Length: 2 mm; Case Code (Metric): 2012; ComponentLink2Description: Datasheet; Radiation Hardening: No
R9 R10 R12 R46 R52 = CMP-2001-01840-1: Manufacturer: KOA Speer; Part Number: RK73B2ATTD510J
R15-R17 R40 = CMP-2100-03669-1: Chip Resistor, 100 Ohm, +/-1%, 0.125 W, -55 to 155 degC, 0805 (2012 Metric), RoHS, Tape and Reel; Manufacturer: Yageo; Power Rating: 125mW; Resistance: 100Ohm; Voltage Rating: 150V; Tolerance: 1%; Temperature Coefficient: 100ppm/degreesC; Length: 2mm; Package Description: 2-Pin Surface Mounted Device, Body 2 x 1.25 mm; Case Code (Imperial): 0805; Number of Pins: 2; Termination: SMD/SMT; Lead Pitch: 0.4mm; Package Quantity: 1; Height: 0.024inch; Case Code (Metric): 2012; Number of Terminations: 2; Datasheet Version: Rev. 5, 10/2016; Lead Free: LeadFree; Package Reference: 0805; Composition: ThickFilm; REACH SVHC: Unknown; Voltage Rating (DC): 150V; Min Operating Temperature: -55degC; Packaging: TapeandReel; Military Standard: Not; Case/Package: 0805; Datasheet URL: http://www.yageo.com/NewPortal/yageodocoutput?fileName=/pdf/R-Chip/PYu-RC_Group_51_RoHS_L_5.pdf; Max Operating Temperature: 155degC; Manufacturer URL: http://www.yageo.com/; Max Power Dissipation: 125mW; Width: 0.049inch; Depth: 1.25mm; RoHSCompliant: true
R18-R30 = RC0805: Chip resistor; Tolerance: 5%
  R18: Value: 270
  R19: Value: 15
  R20 R24 R26: Value: 1K
  R21: Value: 47
  R22: Value: 84.6K
  R23: Value: 0
  R25: Value: 0.1
  R27 R30: Value: 10K
  R28: Value: 4.7K
  R29: Value: NC
R32 R34 = CMP-2001-01993-1: Manufacturer: KOA Speer; Part Number: RK73H2ATTD1002F
R33 = Resistor: TC1: 0; SimulationGenericComponent: True; TC2: 0
R35-R39 R41 R43 R45 R47 R49-R51 R53-R57 R59 R60 = CMP-1659-00015-4: Chip Resistor, 33 Ohm, +/- 1%, 0.125 W, -55 to 155 degC, 0805 (2012 Metric), RoHS, Tape and Reel; Manufacturer: Yageo; Voltage Rating: 150 V; Max Operating Temperature: 155 degC; DatasheetVersion: Rev. 4, 02/2016; RoHSCompliant: true; ComponentLink2Description: Datasheet; PackageDescription: 2-Pin Surface Mounted Device, Body 2 x 1.25 mm; Package Quantity: 5000; Packaging: Tape and Reel; Min Operating Temperature: -55 degC; Mount: Surface Mount; REACH SVHC: No SVHC; ComponentLink1Description: Manufacturer URL; ComponentLink1URL: http://www.yageo.com/; Pins: 2; Mounting Technology: Surface Mount; Height: 0.5 mm; ComponentLink2URL: http://www.yageo.com/documents/recent/PYu-RC_Group_51_RoHS_L_04.pdf; PackageReference: 0805; Length: 2 mm
R42 R48 = CMP-2001-01391-1: Manufacturer: Yageo; Part Number: RC0805JR-075R1L
R58 = CMP-2001-02011-1: Manufacturer: KOA Speer; Part Number: RK73H2ATTD10R0F
TP1-TP14 = TestPoint: Test Point, Orange, 1-Pin THD, RoHS; Peak Reverse Current: 600 uA; Forward Current: 3 A; Max Surge Current: 80 A; Forward Voltage: 1.08 V; Max Operating Temperature: 150 degC; PackageReference: 5003; Pins: 2; ComponentLink2URL: http://keyelco.com/userAssets/file/M65p56.pdf; PackageDescription: 1-Pin Through Hole Device, Dia 2.54 mm; Weight: 0.01 lb; Diameter: 5.3 mm; Mount: Through Hole; Package Quantity: 500; Packaging: Bulk; Min Operating Temperature: -65 degC; ComponentLink1Description: Manufacturer URL; Height: 0.25 inch; ComponentLink1URL: http://www.keyelco.com/; ComponentLink2Description: Datasheet; Width: 0.25 inch; REACH SVHC: No SVHC; RoHSCompliant: true; Radiation Hardening: No; Length: 9.5 mm; DatasheetVersion: Jun-15
U1 = CMP-09116-000192-1: IC OPAMP VFB 4 CIRCUIT 14TSSOP; Min Supply Voltage: 2.7V; -3db Bandwidth: 180MHz; Power Supply Rejection Ratio (PSRR): 98dB; Operating Supply Current: 1mA; Gain Bandwidth Product: 170MHz; Number of Circuits: 4; Common Mode Rejection Ratio: 96dB; Output Current per Channel: 80mA; Slew Rate: 225V/µs; Input Bias Current: 1.2uA; Max Supply Voltage: 11V; Dual Supply Voltage: 5V; Voltage Gain: 130dB; Input Offset Voltage (Vos): 140uV; Packaging: Tape and Reel; Mount: Surface Mount; RoHS Compliant: Yes; Min Operating Temperature: -40°C; Case/Package: TSSOP; Max Operating Temperature: 125°C; Number of Pins: 14; Lead Free: Contains Lead
U2 = CMP-0475-00260-1: Low Noise Dual Supply Inverting Charge Pump, 4.5 to 32 V Vin, Adjustable Vout, 16-pin SOP (MSE-16-EDP), -40 to 125 degC, Pb-Free, Tape and Reel; Manufacturer: Linear Technology; Max Iout(mA): 100; Isupply(mA): 0.1; Ishutdown(uA): 2; Vin Min(V): 4.5; Frequency(kHz): 500; Vin Max(V): 32; Voutput: Adj; ComponentLink2URL: http://cds.linear.com/docs/en/datasheet/3260fa.pdf; PartNumber: LTC3260EMSE#TRPBF; PackageReference: MSE-16; Mounting Technology: Surface Mount; DatasheetVersion: Rev. A; ComponentLink3URL: http://cds.linear.com/docs/en/packaging/05081667_F_MSE16.pdf; ComponentLink1Description: Manufacturer URL; ComponentLink1URL: http://www.linear.com/; Packing: Tape and Reel; RoHS: TRUE; PackageDescription: 16-Pin Plastic MSOP, Exposed Die Pad, Body 4.039 x 3 mm, Pitch 0.5 mm; ComponentLink3Description: Package Specification; ComponentLink2Description: Datasheet; PackageVersion: Rev. F, 05/2013
U3 = CMP-04912-000077-1: IC GATE DRVR LOW-SIDE SOT23-6; Fall Time: 7ns; Output Current: 5A; Number of Channels: 1; Turn-Off Delay Time: 17ns; Number of Outputs: 2; Max Supply Voltage: 35V; Turn-On Delay Time: 26ns; Rise Time: 15ns; Min Supply Voltage: 10V; Operating Supply Voltage: 32V; Mount: Surface Mount; Min Operating Temperature: -40°C; Series: -; Number of Drivers: 1; Lead Free: Lead Free; Max Operating Temperature: 125°C; Packaging: Tape and Reel; Case/Package: SOT-23-6; RoHS Compliant: Yes; Package Quantity: 1; Number of Pins: 6
U4 = CMP-0244-00310-1: Fixed Low Drop Positive Voltage Regulator, 3.3V, 4-Pin SOT-223, Tape and Reel; ComponentLink2Description: Datasheet; PackageDescription: 4-Pin SOT-223 Package, 6.5 x 3.5 mm Body, 2.3 mm Pitch, 7 mm Lead Span; PackageVersion: 2010; ComponentLink2URL: http://www.st.com/internet/com/TECHNICAL_RESOURCES/TECHNICAL_LITERATURE/DATASHEET/CD00000544.pdf; PackageReference: SOT-223; DatasheetVersion: 1/11/2011; ComponentLink1Description: Manufacturer URL; ComponentLink1URL: http://www.st.com
U5 = CMP-0859-00373-3: Single 2-Input Exclusive-OR Gate, DCK0005A, LARGE T&R; Manufacturer: Texas Instruments; Bits(#): 1; Sub-Family: XOR Gate; Output Type: CMOS; ICC @ Nom Voltage(Max)(mA): 0.01; Output Drive (IOL/IOH)(Max)(mA): 9/-9; F @ Nom Voltage(Max)(Mhz): 250; 3-State Output: No; Gate Type: XOR; Technology Family: AUC; Logic: True; VCC(Min)(V): 0.8; VCC(Max)(V): 2.7; tpd @ Nom Voltage(Max)(ns): 5.5,3.8,2.6,1.7,1.3; Rating: Catalog; Voltage(Nom)(V): 0.8,1.2,1.5,1.8,2.5; Generic Part Number: SN74AUC1G86; Schmitt Trigger: No; DatasheetVersion: SCES389J; PackageReference: DCK0005A; Input Type: CMOS; Operating Temperature Range(C): -40 to 85
U6 = CMP-09081-000363-1: IC ADC 16BIT PIPELINED 48QFN; Interface: Parallel; Sampling Rate: 25000000S/s; Max Power Dissipation: 264mW; Number of Converters: 1; Supply Type: Single; Number of Bits: 16; Case/Package: QFN; Min Operating Temperature: 0°C; Mount: Surface Mount; Package Quantity: 2000; RoHS Compliant: Yes; Max Operating Temperature: 75°C; Number of Pins: 48; Packaging: Tape and Reel
U7 = CMP-06324-000075-1: IC REG LINEAR 3V 300MA SOT23-5; Min Current Limit: 400mA; Dropout Voltage: 160mV; Number of Regulators: 1; Output Voltage: 3V; RoHS Compliant: Yes; Max Operating Temperature: 125°C; Packaging: Tape and Reel; Mount: Surface Mount; Output Current: 300mA; Min Operating Temperature: -40°C; Case/Package: SOT-23-5
U8 U12 = 74VCX245BQX: IC TXRX NON-INVERT 3.6V 20-DQFN
U10 = CMP-09116-000202-1: IC OPAMP DIFF 1 CIRCUIT 8MSOP; RoHS Compliant: Yes
U11 = CMP-06324-000114-1: IC REG LIN 3.3V 150MA TSOT23-5; Min Current Limit: 200mA; Min Input Voltage: 2.5V; Output Voltage Accuracy: 2%; Max Input Voltage: 5.5V; Output Configuration: Positive; Dropout Voltage: 155mV; Quiescent Current: 39uA; Power Supply Rejection Ratio (PSRR): 65dB; Output Type: Fixed; Number of Regulators: 1; Package Quantity: 1; Max Operating Temperature: 125°C; Min Output Voltage: 3.3V; Series: -; Packaging: Tape and Reel; RoHS Compliant: Yes; Number of Pins: 23; Polarity: Positive; Number of Outputs: 1; Output Current: 150mA; Case/Package: SOT-23-5; Output Voltage: 3.3V; Min Operating Temperature: -40°C; Mount: Surface Mount; Radiation Hardening: No
W1-W5 = Jumper: Jumper Wire; Published: 24-Mar-1999; LatestRevisionDate: 17-Jul-2002; LatestRevisionNote: Re-released for DXP Platform.; PackageReference: RAD-0.2; Publisher: Altium Limited; PackageDescription: Radial Cap, Thru-Hole; 2 Leads; 0.2 in Pin Spacing
X1 = Quartz_SX-6: Quartz_SX-6 (SMD06035C4)